# EAGLE design BR50_MKL_33840_21MTC_J0_002_01_06 (EAGLE 5.10)
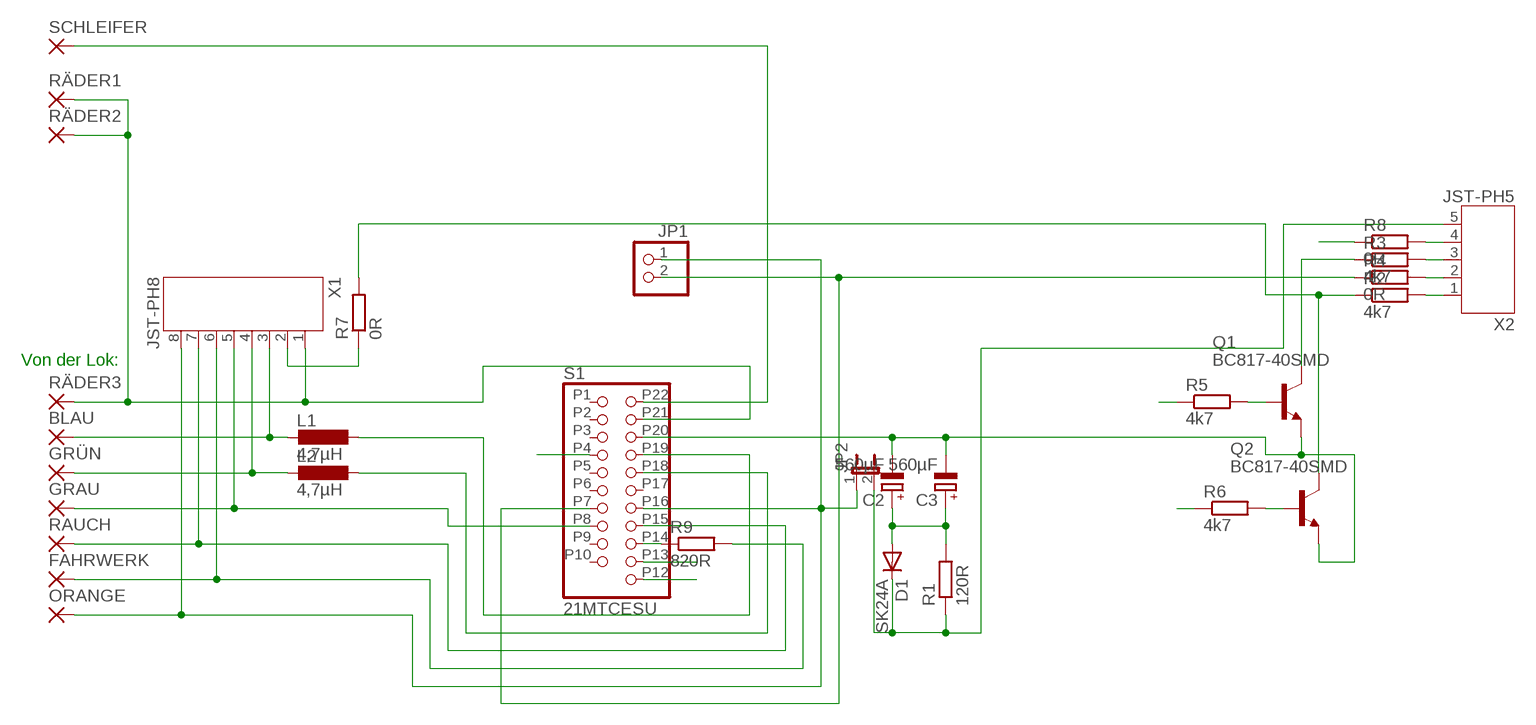
[diagram p0: schematic, sheet 1]

## Parts
BLAU  SMD2  [SMD1,27-2,54]
C2  560µF  CPOL-EU150CLZ-1010  [150CLZ-1010]
C3  560µF  CPOL-EU150CLZ-1010  [150CLZ-1010]
D1  SK24A  ES2D  [SMB]
FAHRWERK  SMD2  [SMD1,27-2,54]
GRAU  SMD2  [SMD1,27-2,54]
GRÜN  SMD2  [SMD1,27-2,54]
JP1  PINHD-1X2/90  [1X02/90]
JP2  JP1E2,00  [JP1_2]
L1  4,7µH  L-EUL1212  [L1212]
L2  4,7µH  L-EUL1212  [L1212]
ORANGE  SMD2  [SMD1,27-2,54]
Q1  BC817-40SMD  [SOT23-BEC]
Q2  BC817-40SMD  [SOT23-BEC]
R1  120R  R-EU_R1206  [R1206]
R2  4k7  R-EU_R0603S  [R0603S]
R3  4k7  R-EU_R0603S  [R0603S]
R4  0R  R-EU_R0603S  [R0603S]
R5  4k7  R-EU_R0603  [R0603]
R6  4k7  R-EU_R0603  [R0603]
R7  0R  R-EU_R0603S  [R0603S]
R8  0R  R-EU_R0603S  [R0603S]
R9  820R  R-EU_R0603S  [R0603S]
RAUCH  SMD2  [SMD1,27-2,54]
RÄDER1  SMD2  [SMD1,27-2,54]
RÄDER2  SMD2  [SMD1,27-2,54]
RÄDER3  SMD2  [SMD1,27-2,54]
S1  21MTCESU  [21MTC_SMD_ESU]
SCHLEIFER  SMD2  [SMD1,27-2,54]
X1  JST-PH8  [JST-PH8]
X2  JST-PH5  [JST-PH5]

## Nets
BLAU: L1.1 S1.P19
F1RAUCH: RAUCH.1(P) S1.P15 X1.7
F2FAHRWERK: FAHRWERK.1(P) R9.2 X1.6
F3FÜHRER: R6.1 S1.P13
F4KABINE: R5.1 S1.P4
GELB: JP1.2 R4.1 S1.P7
GND: C2.- C3.- Q1.E Q2.E S1.P20
GRAU: GRAU.1(P) R8.1 S1.P8 X1.5
GRÜN: L2.1 S1.P18
N$1: C2.+ C3.+ D1.A R1.2
N$2: R4.2 X2.2
N$3: R3.2 X2.3
N$4: D1.C JP2.2 R1.1 X2.5
N$5: Q2.C R2.1 R7.2
N$6: Q1.C R3.1
N$7: Q1.B R5.2
N$8: Q2.B R6.2
N$9: R7.1 X1.2
N$10: R2.2 X2.1
N$11: R8.2 X2.4
N$12: BLAU.1(P) L1.2 X1.3
N$13: GRÜN.1(P) L2.2 X1.4
N$14: R9.1 S1.P14
ORANGE: JP1.1 JP2.1 ORANGE.1(P) S1.P16 X1.8
RÄDER: RÄDER1.1(P) RÄDER2.1(P) RÄDER3.1(P) S1.P21 X1.1
SCHLEIFER: S1.P22 SCHLEIFER.1(P)
VCC: S1.P12
Unconnected: S1.P1 S1.P2 S1.P3 S1.P5 S1.P6 S1.P9 S1.P10 S1.P17

## Notes on the sheet
- Von der Lok:

## Library data of the parts
BLAU FAHRWERK GRAU GRÜN ORANGE RAUCH RÄDER1-RÄDER3 SCHLEIFER = wirepad:SMD2: SMD PAD
C2 C3 = rcl:CPOL-EU: POLARIZED CAPACITOR, European symbol
D1 = diode:ES2D: DIODE super fast rectifier, 2 A
JP1 = pinhead:PINHD-1X2: PIN HEADER
JP2 = jumper:JP1E: JUMPER
L1 L2 = rcl:L-EU: INDUCTOR, European symbol
Q1 Q2 = transistor-npn:BC817*: NPN Transistor
R1-R9 = rcl:R-EU_: RESISTOR, European symbol
S1 = pinhead:21MTC
X1 = jst-ph:JST-PH8
X2 = jst-ph:JST-PH5

## Board
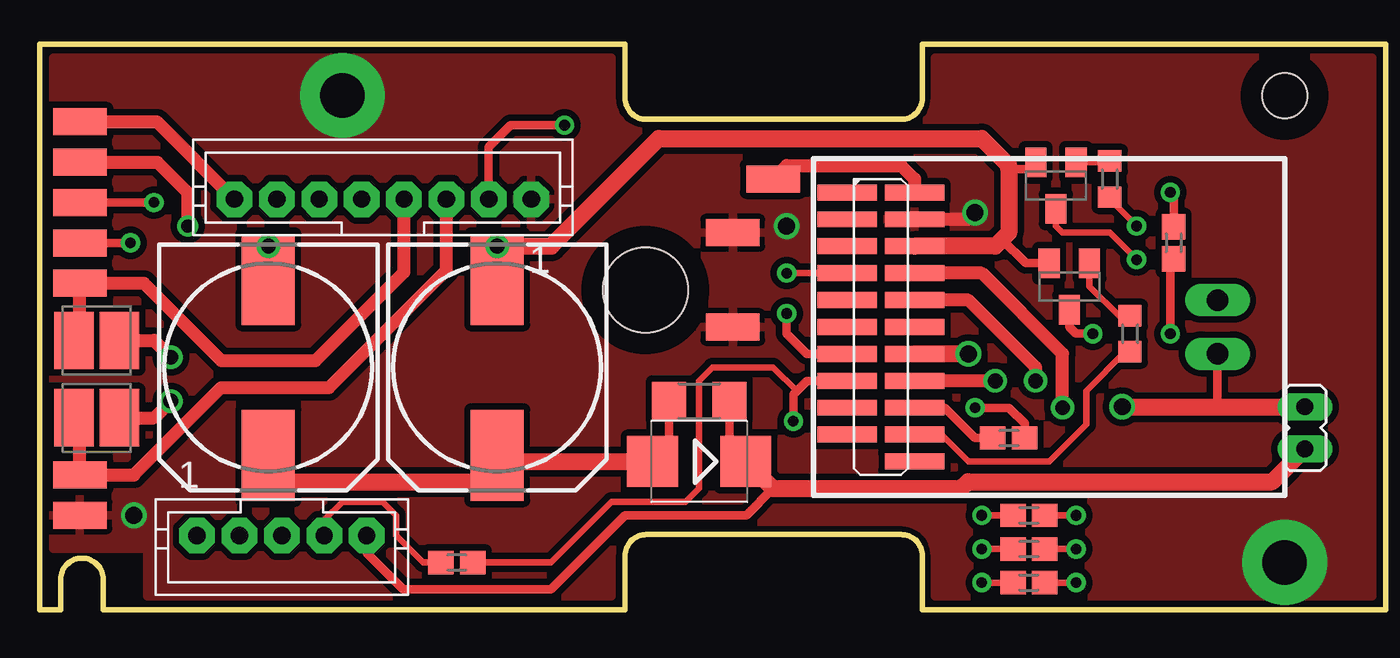
[diagram p1: board, top side]
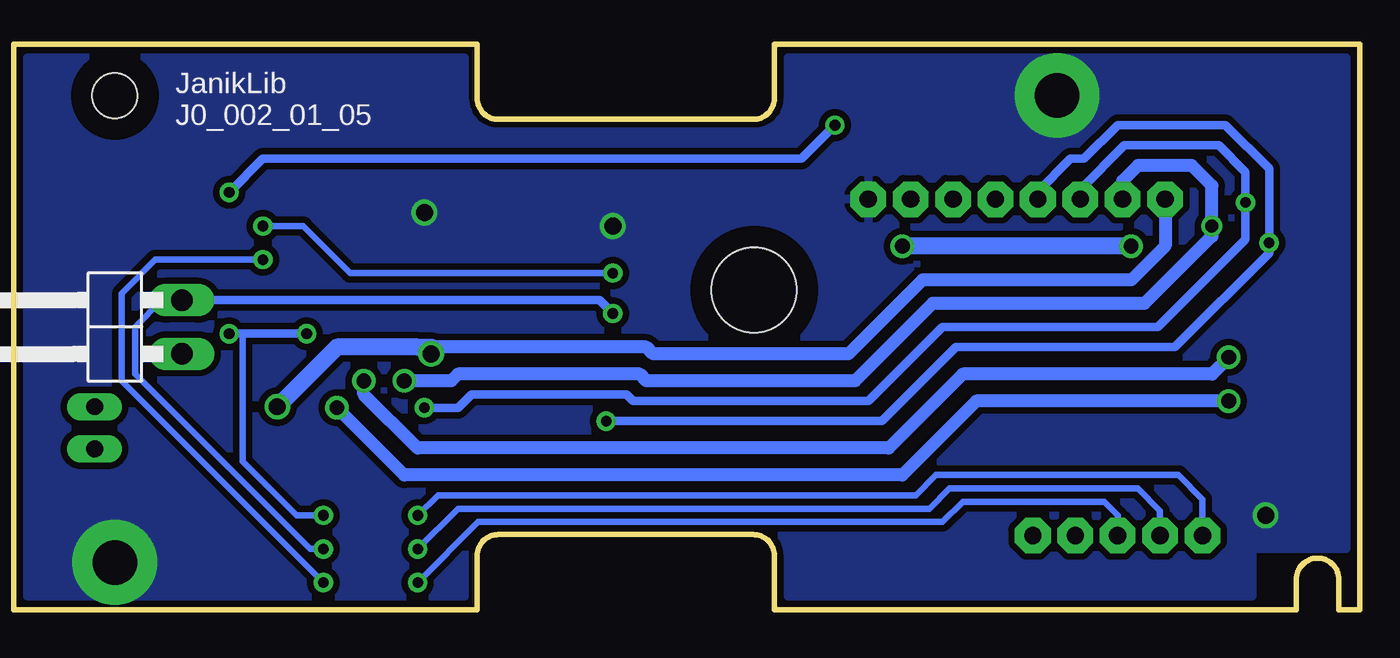
[diagram p2: board, bottom side, seen from below]

No outline drawn. Coordinates in mm, seen from the top.
Copper layers (1*16): Top 0.035mm / dielectric 1.5mm / Bottom 0.035mm
Design rules "default *": minimum track width 10mil, minimum drill 0.6mm, track to track 8mil, track to pad 8mil, pad to pad 8mil, via to via 8mil, smd to smd 8mil, copper to edge 40mil, drill to drill 8mil, minimum pad ring 10mil, minimum via ring 8mil, stop-mask expansion 4mil, vias tented up to drill 0mil, thermal gap 10mil
Holes 2.1 mm at 58.74,24.25
Holes 4 mm at 28.57,15.08
Milling: 21 lines

### Footprints (pad centres in the part's own frame; a part is rotated, then mirrored left to right if it is on the bottom)
SMD1,27-2,54 = smd 1.27 x 2.54: 1 0,0
150CLZ-1010 = smd 4.3 x 2.5: + 4.15,0; - -4.15,0
SMB = smd 2.4 x 2.4: A 2.2,0; C -2.2,0
1X02/90 = drill 1.016 long: 1 -1.27,-3.81; 2 1.27,-3.81
JP1_2 = drill 0.8 long: 1 0,-1; 2 0,1
L1212 = smd 1.85 x 2.7: 1 -1.075,0; 2 1.075,0
SOT23-BEC = smd 1 x 1.4: B -0.95,-1.1; C 0,1.1; E 0.95,-1.1
R1206 = smd 1.6 x 1.803: 1 -1.422,0; 2 1.422,0
R0603S = smd 1.2 x 1.1: 1 -0.75,0; 2 0.75,0
R0603 = smd 1 x 1.1: 1 -0.85,0; 2 0.85,0
21MTC_SMD_ESU = smd 0.75 x 2.8: P1 -6.35,-0.953; P2 -5.08,-0.953; P3 -3.81,-0.953; P4 -2.54,-0.953; P5 -1.27,-0.953; P6 0,-0.953; P7 1.27,-0.953; P8 2.54,-0.953; P9 3.81,-0.953; P10 5.08,-0.953; P12 6.35,2.223; P13 5.08,2.223; P14 3.81,2.223; P15 2.54,2.223; P16 1.27,2.223; P17 0,2.223; P18 -1.27,2.223; P19 -2.54,2.223; P20 -3.81,2.223; P21 -5.08,2.223; P22 -6.35,2.223
JST-PH8 = drill 0.813 pad 1.676 octagon: 1 7,0; 2 5,0; 3 3,0; 4 1,0; 5 -1,0; 6 -3,0; 7 -5,0; 8 -7,0
JST-PH5 = drill 0.813 pad 1.676 octagon: 1 4,0; 2 2,0; 3 0,0; 4 -2,0; 5 -4,0

### Placement (x,y rotation side)
BLAU  1.91,6.35 90 top
C2  10.79,11.43 270 top
C3  21.59,11.43 270 top
D1  31.11,6.99 180 top
FAHRWERK  1.91,19.21 270 top
GRAU  1.91,17.3 270 top
GRÜN  1.9,15.4 90 top
JP1  59.37,13.34 90 bottom
JP2  59.69,8.57 180 top
L1  2.7,9.05 180 top
L2  2.7,12.7 180 top
ORANGE  1.91,23.02 270 top
Q1  47.94,20 180 top
Q2  48.58,15.24 180 top
R1  31.11,9.84 180 top
R2  46.67,4.45 180 top
R3  46.67,1.27 180 top
R4  46.67,2.86 180 top
R5  50.48,20.32 90 top
R6  51.44,13.02 90 top
R7  53.5,17.3 270 top
R8  19.68,2.22 180 top
R9  45.72,8.1 0 top
RAUCH  1.91,21.11 270 top
RÄDER1  32.7,13.34 90 top
RÄDER2  32.7,17.78 90 top
RÄDER3  1.91,4.45 270 top
S1  39.05,13.34 270 top
SCHLEIFER  34.61,20.32 90 top
X1  16.19,19.37 0 top
X2  11.43,3.49 180 top

### Tracks (layer width: path | path; a pad name or v marks a point on that pad's centre or on a via)
BLAU  (via drill 0.7)
  Top 0.61: v48.26,9.53 48.26,12.06 44.45,15.88 S1.P19 | v6.19,9.84 5.4,9.05 L1.1
  Bottom 0.61: v48.26,9.53 45.09,6.35 21.59,6.35 18.1,9.84 v6.19,9.84
F1RAUCH  (via drill 0.6, 0.7)
  Top 0.61: v45.09,10.79 S1.P15 | RAUCH.1 5.56,21.11 6.99,19.68 v6.99,18.1
  Bottom 0.61: v45.09,10.79 42.86,10.79 42.55,11.11 33.97,11.11 33.66,10.79 23.81,10.79 20.16,14.45 10.16,14.45 6.99,17.62 v6.99,18.1 6.99,20 7.94,20.95 10.48,20.95 11.19,20.24 X1.7
F2FAHRWERK  (via drill 0.5)
  Top 0.406: FAHRWERK.1 v5.4,19.21 | R9.2 46.47,8.78 45.72,9.53 v44.13,9.53
  Bottom 0.406: v44.13,9.53 42.55,9.53 41.91,10.16 34.61,10.16 34.29,9.84 23.18,9.84 19.68,13.34 9.53,13.34 5.4,17.46 | X1.6 13.19,19.83 11.11,21.91 6.67,21.91 5.4,20.64 v5.4,19.21 5.4,17.46 | 5.4,17.46
F3FÜHRER
  Top 0.305: S1.P13 42.55,8.26 43.81,6.99 47.62,6.99 49.37,8.73 49.37,10.32 51.22,12.17 R6.1
F4KABINE  (via drill 0.5)
  Top 0.305: v35.24,15.88 S1.P4 | R5.1 50.48,19.37 v51.75,18.1
  Bottom 0.305: v35.24,15.88 47.62,15.88 49.85,18.1 v51.75,18.1
GELB  (via drill 0.5)
  Top 0.305: v48.9,2.86 R4.1
  Top 0.406: S1.P7 36.2,12.06 35.24,13.02 v35.24,13.97
  Bottom 0.305: v48.9,2.86 49.53,2.86 57.78,11.11 57.78,13.34 56.52,14.61 JP1.2
  Bottom 0.406: v35.24,13.97 35.88,14.61 JP1.2
GND  (via drill 0.7)
  Top 0.406: Q2.E 46.52,16.34 45.4,17.46 | 45.72,20.79 46.67,20.79 Q1.E
  Top 0.813: S1.P20 45.09,17.14 45.4,17.46 45.72,17.78 45.72,20.79 45.72,20.95 44.45,22.23 29.21,22.23 24.13,17.14 v21.59,17.14 C3.- | C2.- v10.79,17.14
  Bottom 0.813: v10.79,17.14 v21.59,17.14
GRAU  (via drill 0.5)
  Top 0.305: R8.1 24.13,2.22 26.99,5.08 30.48,5.08 31.11,5.71 31.11,10.79 31.75,11.43 34.61,11.43 35.72,10.32
  Top 0.406: S1.P8 36.2,10.79 35.72,10.32 35.56,10.16 v35.56,8.89 | GRAU.1 v4.29,17.3
  Bottom 0.406: v35.56,8.89 22.54,8.89 19.05,12.38 8.73,12.38 4.29,16.83 v4.29,17.3 4.29,19.84 4.29,20.8 6.35,22.86 11.43,22.86 13.02,21.27 13.65,21.27 15.19,19.73 X1.5
GRÜN  (via drill 0.7)
  Top 0.61: v46.99,10.79 46.99,11.43 43.81,14.61 S1.P18 | v6.19,11.91 5.4,12.7 L2.1
  Bottom 0.61: v46.99,10.79 46.99,10.16 44.45,7.62 22.23,7.62 18.73,11.11 6.99,11.11 v6.19,11.91
N$1
  Top 0.406: D1.A 29.69,7.76 R1.2
  Top 0.813: C2.+ 10.79,6.03 21.59,6.03 C3.+ 21.59,6.99 D1.A 28.26,6.96
N$2  (via drill 0.5)
  Top 0.305: v44.45,2.86 R4.2
  Bottom 0.305: v44.45,2.86 42.55,4.76 20.32,4.76 19.37,5.71 10.48,5.71 9.43,4.67 X2.2
N$3  (via drill 0.5)
  Top 0.305: v44.45,1.27 R3.2
  Bottom 0.305: v44.45,1.27 41.59,4.13 19.68,4.13 18.73,5.08 12.06,5.08 11.43,4.45 X2.3
N$4
  Top 0.406: 34.61,5.71 33.34,4.45 27.62,4.45 24.13,0.95 17.14,0.95 15.43,2.67 X2.5 | D1.C 32.54,7.76 R1.1
  Top 0.813: D1.C 33.34,6.99 34.61,5.71 43.5,5.71 43.81,6.03 58.15,6.03 JP2.2
N$5  (via drill 0.5)
  Top 0.305: R2.1 v48.9,4.45
  Top 0.406: Q2.C 48.58,13.34 48.9,13.02 v49.69,13.02 | R7.2 53.34,16.39 v53.34,13.02
  Bottom 0.305: v48.9,4.45 50.16,4.45 52.7,6.99 52.7,13.02
  Bottom 0.406: v53.34,13.02 52.7,13.02 v49.69,13.02
N$6  (via drill 0.5)
  Top 0.305: Q1.C 47.94,18.1 48.26,17.78 50.48,17.78 v51.75,16.51 | R3.1 v48.9,1.27
  Bottom 0.305: v51.75,16.51 56.83,16.51 58.42,14.92 58.42,10.79 v48.9,1.27
N$7
  Top 0.305: Q1.B 50.41,21.1 R5.2
N$8
  Top 0.305: Q2.B 49.53,15.24 50.9,13.87 R6.2
N$9  (via drill 0.5)
  Top 0.406: R7.1 53.5,19.53 v53.34,19.68 | v24.77,22.86 22.23,22.86 21.19,21.83 X1.2
  Bottom 0.406: v53.34,19.68 51.75,21.27 26.35,21.27 v24.77,22.86
N$10  (via drill 0.5)
  Top 0.305: v44.45,4.45 R2.2
  Bottom 0.305: v44.45,4.45 43.5,5.4 20.95,5.4 20,6.35 8.57,6.35 7.43,5.21 X2.1
N$11
  Top 0.305: X2.4 13.43,4.22 14.29,5.08 16.19,5.08 16.83,4.45 16.83,3.49 18.1,2.22 R8.2
N$12
  Top 0.61: X1.3 19.19,16.02 13.65,10.48 8.57,10.48 4.45,6.35 BLAU.1 1.91,8.77 L1.2
N$13
  Top 0.61: X1.4 17.19,15.92 13.02,11.75 8.57,11.75 4.92,15.4 GRÜN.1 1.91,12.98 L2.2
N$14
  Top 0.406: R9.1 44.13,8.1 42.7,9.53 S1.P14
ORANGE  (via drill 0.8)
  Top 0.406: 55.56,9.57 JP1.1
  Top 0.61: X1.8 5.54,23.02 ORANGE.1
  Top 0.813: v43.81,12.06 S1.P16 | JP2.1 55.56,9.57 v51.07,9.57
  Bottom 0.61: 44.45,12.38 33.66,12.38 33.34,12.06 24.13,12.06 20.64,15.56 10.79,15.56 9.19,17.16 X1.8
  Bottom 0.813: v43.81,12.06 43.81,12.38 44.45,12.38 48.26,12.38 v51.07,9.57
RÄDER  (via drill 0.8, 2.1 pad 4)
  Top 0.61: S1.P21 43.81,18.41 v44.13,18.73
  other vias: 14.29,24.27 58.74,2.22 4.45,4.45 35.24,18.1
  pour Bottom (isolate 0.305): 0.64,26.04 0.64,2.86 5.08,2.86 5.08,0.64 26.99,0.64 26.99,2.54 arc-90 28.57,4.13 40.64,4.13 arc-90 42.23,2.54 42.23,0.64 62.87,0.64 62.87,26.04 42.23,26.04 42.23,24.13 arc-90 40.64,22.54 28.57,22.54 arc-90 26.99,24.13 26.99,26.04
  pour Top (isolate 0.305): 0.64,26.04 0.64,2.86 5.08,2.86 5.08,0.64 26.99,0.64 26.99,2.54 arc-90 28.57,4.13 40.64,4.13 arc-90 42.23,2.54 42.23,0.64 62.87,0.64 62.87,26.04 42.23,26.04 42.23,24.13 arc-90 40.64,22.54 28.57,22.54 arc-90 26.99,24.13 26.99,26.04
SCHLEIFER
  Top 0.61: SCHLEIFER.1 35.24,20.95 40.64,20.95 41.27,20.32 S1.P22

### Text on the board
bNames: JanikLib | J0_002_01_05
tStop: für Märklin | 33840 | BR50 21MTC | AUX3 | Fahrwerk | AUX3 | Vorne | Hinten | design by Janik Merz | AUX4
bStop: JST PH | design by Janik Merz | BR50 21MTC